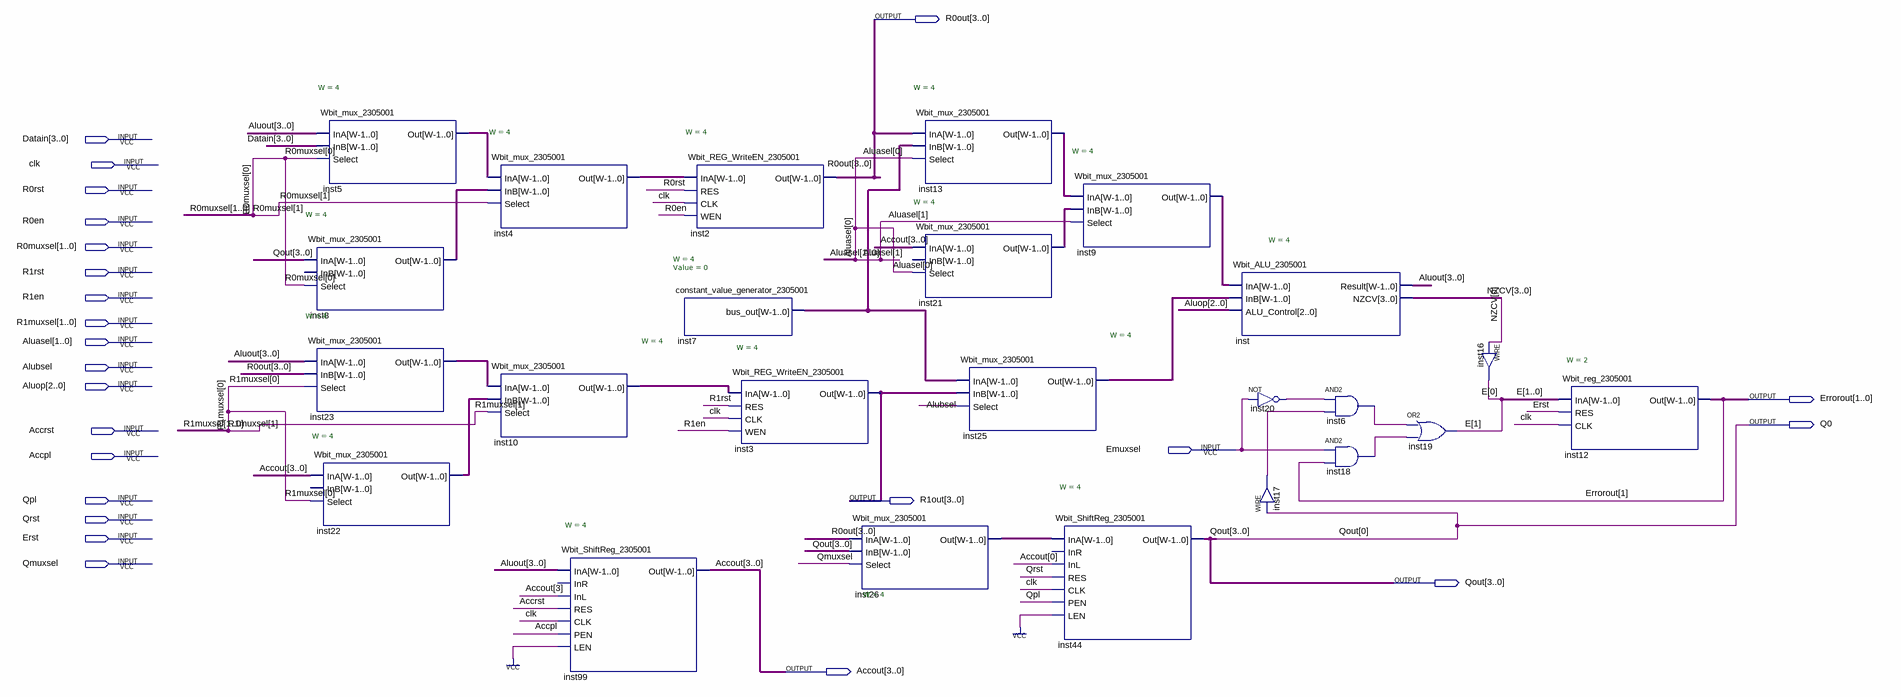
[diagram p0: schematic sheet]
// Quartus schematic Schematic_connection.bdf as structural Verilog: 24 symbols, 24 pins
module Schematic_connection (
  input  [3:0] Datain,
  input  clk,
  input  R0rst,
  input  R0en,
  input  [1:0] R0muxsel,
  input  R1rst,
  input  R1en,
  input  [1:0] R1muxsel,
  input  [1:0] Aluasel,
  input  Alubsel,
  input  [2:0] Aluop,
  input  Accrst,
  input  Emuxsel,
  input  Accpl,
  input  Qpl,
  input  Qrst,
  input  Erst,
  input  Qmuxsel,
  output [3:0] R0out,
  output [1:0] Errorout,
  output Q0,
  output [3:0] R1out,
  output [3:0] Qout,
  output [3:0] Accout
);

  wire inst6_out, inst17_out, inst18_out, inst20_out;
  wire [1:0] E;
  wire [3:0] Aluout, inst4_out, inst5_out, inst7_bus_out, inst8_out, inst9_out, inst10_out, inst13_out,
       inst21_out, inst22_out, inst23_out, inst25_out, inst26_out, NZCV;

  Wbit_mux_2305001 #(.W(4)) inst5 (.InA(Aluout), .InB(Datain), .Select(R0muxsel[0]), .Out(inst5_out));
  Wbit_mux_2305001 #(.W(4)) inst8 (.InA({Qout[3:1], Q0}), .Select(R0muxsel[0]), .Out(inst8_out));  // open: InB
  Wbit_mux_2305001 #(.W(4)) inst23 (.InA(Aluout), .InB(R0out), .Select(R1muxsel[0]), .Out(inst23_out));
  Wbit_mux_2305001 #(.W(4)) inst22 (.InA(Accout), .Select(R1muxsel[0]), .Out(inst22_out));  // open: InB
  Wbit_mux_2305001 #(.W(4)) inst4 (.InA(inst5_out), .InB(inst8_out), .Select(R0muxsel[1]), .Out(inst4_out));
  Wbit_mux_2305001 #(.W(4)) inst10 (.InA(inst23_out), .InB(inst22_out), .Select(R1muxsel[1]), .Out(inst10_out));
  Wbit_ShiftReg_2305001 #(.W(4)) inst99 (
    .InA(Aluout), .InL(Accout[3]), .RES(Accrst), .CLK(clk), .PEN(Accpl), .LEN(1'b1), .Out(Accout));  // open: InR
  Wbit_REG_WriteEN_2305001 #(.W(4)) inst2 (.InA(inst4_out), .RES(R0rst), .CLK(clk), .WEN(R0en), .Out(R0out));
  constant_value_generator_2305001 #(.W(4), .Value(0)) inst7 (.bus_out(inst7_bus_out));
  Wbit_REG_WriteEN_2305001 #(.W(4)) inst3 (.InA(inst10_out), .RES(R1rst), .CLK(clk), .WEN(R1en), .Out(R1out));
  Wbit_mux_2305001 #(.W(4)) inst26 (.InA(R0out), .InB({Qout[3:1], Q0}), .Select(Qmuxsel), .Out(inst26_out));
  Wbit_mux_2305001 #(.W(4)) inst13 (.InA(R0out), .InB(inst7_bus_out), .Select(Aluasel[0]), .Out(inst13_out));
  Wbit_mux_2305001 #(.W(4)) inst21 (.InA(Accout), .Select(Aluasel[0]), .Out(inst21_out));  // open: InB
  Wbit_mux_2305001 #(.W(4)) inst25 (.InA(inst7_bus_out), .InB(R1out), .Select(Alubsel), .Out(inst25_out));
  Wbit_ShiftReg_2305001 #(.W(4)) inst44 (
    .InA(inst26_out), .InL(Accout[0]), .RES(Qrst), .CLK(clk), .PEN(Qpl), .LEN(1'b1), .Out({Qout[3:1], Q0}));  // open: InR
  Wbit_mux_2305001 #(.W(4)) inst9 (.InA(inst13_out), .InB(inst21_out), .Select(Aluasel[1]), .Out(inst9_out));
  Wbit_ALU_2305001 #(.W(4)) inst (.InA(inst9_out), .InB(inst25_out), .ALU_Control(Aluop), .Result(Aluout), .NZCV(NZCV));
  not inst20 (inst20_out, Emuxsel);
  assign inst17_out = Q0;  // WIRE inst17
  and inst6 (inst6_out, inst20_out, inst17_out);
  and inst18 (inst18_out, Emuxsel, Errorout[1]);
  or inst19 (E[1], inst6_out, inst18_out);
  assign E[0] = NZCV[0];  // WIRE inst16
  Wbit_reg_2305001 #(.W(2)) inst12 (.InA(E), .RES(Erst), .CLK(clk), .Out(Errorout));

  assign Qout[0] = Q0;
endmodule
